# Altium schematic sheet flash.SchDoc: NOR Flash
size A3; Organization: Berne University of Applied Science; Address1: School of Engineering and; Address2: Information Technology; Address3: Quellgasse 21; Address4: CH-2501 Biel; Revision: 1.0; SheetNumber: 11; SheetTotal: 19; ApprovedBy: zem1; Author: zac1
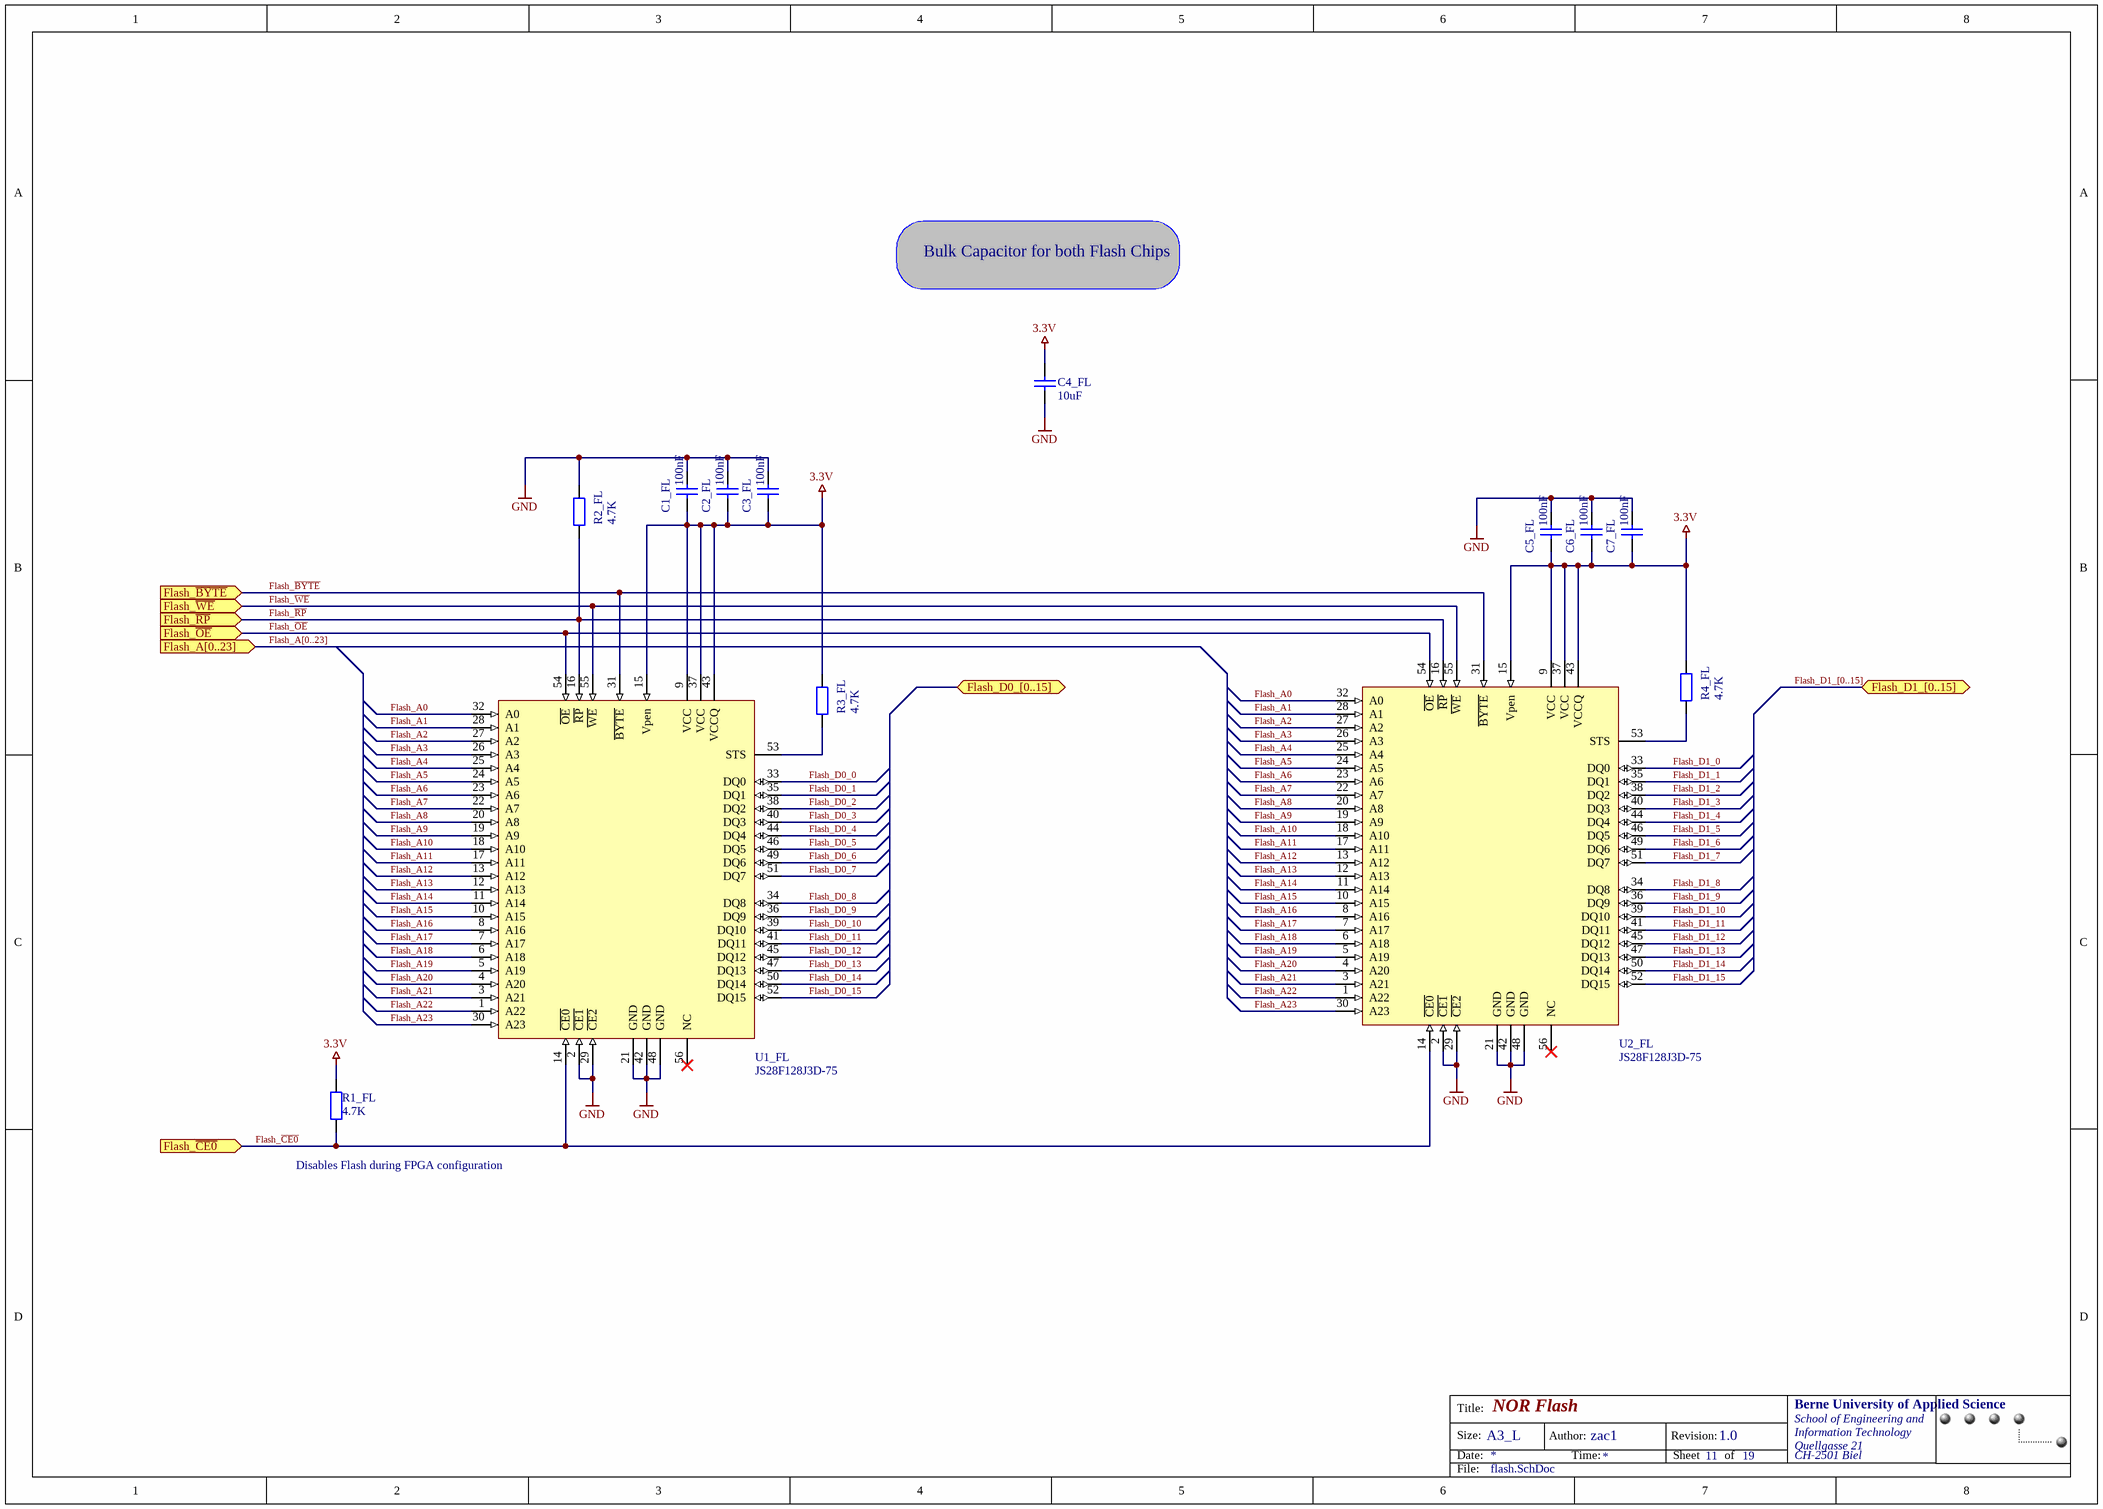
[diagram p0: flash.SchDoc]

## Parts
C1_FL  value 100nF  [0402]  (hidden comment: Cap)
C2_FL  value 100nF  [0402]  (hidden comment: Cap)
C3_FL  value 100nF  [0402]  (hidden comment: Cap)
C4_FL  value 10uF  [1206]  (hidden comment: Cap)
C5_FL  value 100nF  [0402]  (hidden comment: Cap)
C6_FL  value 100nF  [0402]  (hidden comment: Cap)
C7_FL  value 100nF  [0402]  (hidden comment: Cap)
R1_FL  value 4.7K  [0402]  (hidden comment: Res2)
R2_FL  value 4.7K  [0402]  (hidden comment: Res2)
R3_FL  value 4.7K  [0402]  (hidden comment: Res2)
R4_FL  value 4.7K  [0402]  (hidden comment: Res2)
U1_FL  value JS28F128J3D-75  [TSSO14X20-G56]  (hidden comment: JS28FXXXJ3D-75)
U2_FL  value JS28F128J3D-75  [TSSO14X20-G56]  (hidden comment: JS28FXXXJ3D-75)

## Ports
Flash_A[0..23] (in), Flash_D0_[0..15] (bidir), Flash_D1_[0..15] (bidir), Flash_~{BYTE} (in), Flash_~{CE0} (in), Flash_~{OE} (in), Flash_~{RP} (in), Flash_~{WE} (in)

## Nets
3.3V: C1_FL.2 C2_FL.2 C3_FL.2 C4_FL.2 C5_FL.2 C6_FL.2 C7_FL.2 R1_FL.1 R3_FL.2 R4_FL.2 U1_FL.9(VCC) U1_FL.15(Vpen) U1_FL.37(VCC) U1_FL.43(VCCQ) U2_FL.9(VCC) U2_FL.15(Vpen) U2_FL.37(VCC) U2_FL.43(VCCQ)
GND: C1_FL.1 C2_FL.1 C3_FL.1 C4_FL.1 C5_FL.1 C6_FL.1 C7_FL.1 R2_FL.2 U1_FL.2(~{CE1}) U1_FL.21(GND) U1_FL.29(~{CE2}) U1_FL.42(GND) U1_FL.48(GND) U2_FL.2(~{CE1}) U2_FL.21(GND) U2_FL.29(~{CE2}) U2_FL.42(GND) U2_FL.48(GND)
Flash_A0: U1_FL.32(A0) U2_FL.32(A0)
Flash_A1: U1_FL.28(A1) U2_FL.28(A1)
Flash_A2: U1_FL.27(A2) U2_FL.27(A2)
Flash_A3: U1_FL.26(A3) U2_FL.26(A3)
Flash_A4: U1_FL.25(A4) U2_FL.25(A4)
Flash_A5: U1_FL.24(A5) U2_FL.24(A5)
Flash_A6: U1_FL.23(A6) U2_FL.23(A6)
Flash_A7: U1_FL.22(A7) U2_FL.22(A7)
Flash_A8: U1_FL.20(A8) U2_FL.20(A8)
Flash_A9: U1_FL.19(A9) U2_FL.19(A9)
Flash_A10: U1_FL.18(A10) U2_FL.18(A10)
Flash_A11: U1_FL.17(A11) U2_FL.17(A11)
Flash_A12: U1_FL.13(A12) U2_FL.13(A12)
Flash_A13: U1_FL.12(A13) U2_FL.12(A13)
Flash_A14: U1_FL.11(A14) U2_FL.11(A14)
Flash_A15: U1_FL.10(A15) U2_FL.10(A15)
Flash_A16: U1_FL.8(A16) U2_FL.8(A16)
Flash_A17: U1_FL.7(A17) U2_FL.7(A17)
Flash_A18: U1_FL.6(A18) U2_FL.6(A18)
Flash_A19: U1_FL.5(A19) U2_FL.5(A19)
Flash_A20: U1_FL.4(A20) U2_FL.4(A20)
Flash_A21: U1_FL.3(A21) U2_FL.3(A21)
Flash_A22: U1_FL.1(A22) U2_FL.1(A22)
Flash_A23: U1_FL.30(A23) U2_FL.30(A23)
Flash_~{BYTE}: U1_FL.31(~{BYTE}) U2_FL.31(~{BYTE}) ; port Flash_~{BYTE}
Flash_~{CE0}: R1_FL.2 U1_FL.14(~{CE0}) U2_FL.14(~{CE0}) ; port Flash_~{CE0}
Flash_D0_0: U1_FL.33(DQ0)
Flash_D0_1: U1_FL.35(DQ1)
Flash_D0_2: U1_FL.38(DQ2)
Flash_D0_3: U1_FL.40(DQ3)
Flash_D0_4: U1_FL.44(DQ4)
Flash_D0_5: U1_FL.46(DQ5)
Flash_D0_6: U1_FL.49(DQ6)
Flash_D0_7: U1_FL.51(DQ7)
Flash_D0_8: U1_FL.34(DQ8)
Flash_D0_9: U1_FL.36(DQ9)
Flash_D0_10: U1_FL.39(DQ10)
Flash_D0_11: U1_FL.41(DQ11)
Flash_D0_12: U1_FL.45(DQ12)
Flash_D0_13: U1_FL.47(DQ13)
Flash_D0_14: U1_FL.50(DQ14)
Flash_D0_15: U1_FL.52(DQ15)
Flash_D1_0: U2_FL.33(DQ0)
Flash_D1_1: U2_FL.35(DQ1)
Flash_D1_2: U2_FL.38(DQ2)
Flash_D1_3: U2_FL.40(DQ3)
Flash_D1_4: U2_FL.44(DQ4)
Flash_D1_5: U2_FL.46(DQ5)
Flash_D1_6: U2_FL.49(DQ6)
Flash_D1_7: U2_FL.51(DQ7)
Flash_D1_8: U2_FL.34(DQ8)
Flash_D1_9: U2_FL.36(DQ9)
Flash_D1_10: U2_FL.39(DQ10)
Flash_D1_11: U2_FL.41(DQ11)
Flash_D1_12: U2_FL.45(DQ12)
Flash_D1_13: U2_FL.47(DQ13)
Flash_D1_14: U2_FL.50(DQ14)
Flash_D1_15: U2_FL.52(DQ15)
Flash_~{OE}: U1_FL.54(~{OE}) U2_FL.54(~{OE}) ; port Flash_~{OE}
Flash_~{RP}: R2_FL.1 U1_FL.16(~{RP}) U2_FL.16(~{RP}) ; port Flash_~{RP}
Flash_~{WE}: U1_FL.55(~{WE}) U2_FL.55(~{WE}) ; port Flash_~{WE}
NetR3_FL_1: R3_FL.1 U1_FL.53(STS)
NetR4_FL_1: R4_FL.1 U2_FL.53(STS)

Not connected (* = marked no-connect by the designer): U1_FL 56(NC)*; U2_FL 56(NC)*

## Buses and harness runs
bus Flash_A[0..23] = port Flash_A[0..23]
bus Flash_D1_[0..15] = port Flash_D1_[0..15]

## Notes on the sheet
- Bulk Capacitor for both Flash Chips
- (near R1_FL) Disables Flash during FPGA configuration
- Title:
- Size:
- Date:
- A3_L
- Author:
- Time:
- Revision:
- Sheet
- of
- File:

## Library data of the parts
C1_FL C2_FL C3_FL C5_FL C6_FL C7_FL = Cap: Capacitor; Manufacturer: Murata; Part Number: GRM155R71C104KA88D; Class I: Passive; Currency: CHF; Packaging unit: 10; Prize: 0.07; Published: 8-Jun-2000; Revision: July-2002: Re-released for DXP Platform.; Publisher: Altium Limited; Class II: Capacitor; Distributor Number: 8819 742; RoHS: yes; Distributor: Farnell
C4_FL = Cap: Capacitor; Manufacturer: Murata; Part Number: GRM31CR70J106KA01L; Class I: Passive; Currency: CHF; Packaging unit: 1; Prize: 0.25; Published: 8-Jun-2000; Revision: July-2002: Re-released for DXP Platform.; Publisher: Altium Limited; Class II: Capacitor; Distributor Number: 9527 729; RoHS: yes; Distributor: Farnell
R1_FL R2_FL R3_FL R4_FL = Res2: Resistor; Manufacturer: PHYCOMP; Part Number: 232270674702; Class I: Passive; Currency: CHF; Packaging unit: 50; Prize: 0.12; Published: 8-Jun-2000; Revision: July-2002: Re-released for DXP Platform.; Publisher: Altium Limited; Class II: Resistor; Distributor Number: 9239316; RoHS: yes; Distributor: Farnell
U1_FL U2_FL = JS28FXXXJ3D-75: Intel embedded Flash J3; Currency: $; Packaging unit: 96; Prize: 10.2; lead time: 13 Weeks; Distributor Number: JS28F128J3D-75; Manufacturer: Intel; Part Number: JS28F128J3D-75; RoHS: yes; Distributor: Silica